# Altium schematic sheet Power.SchDoc
size C
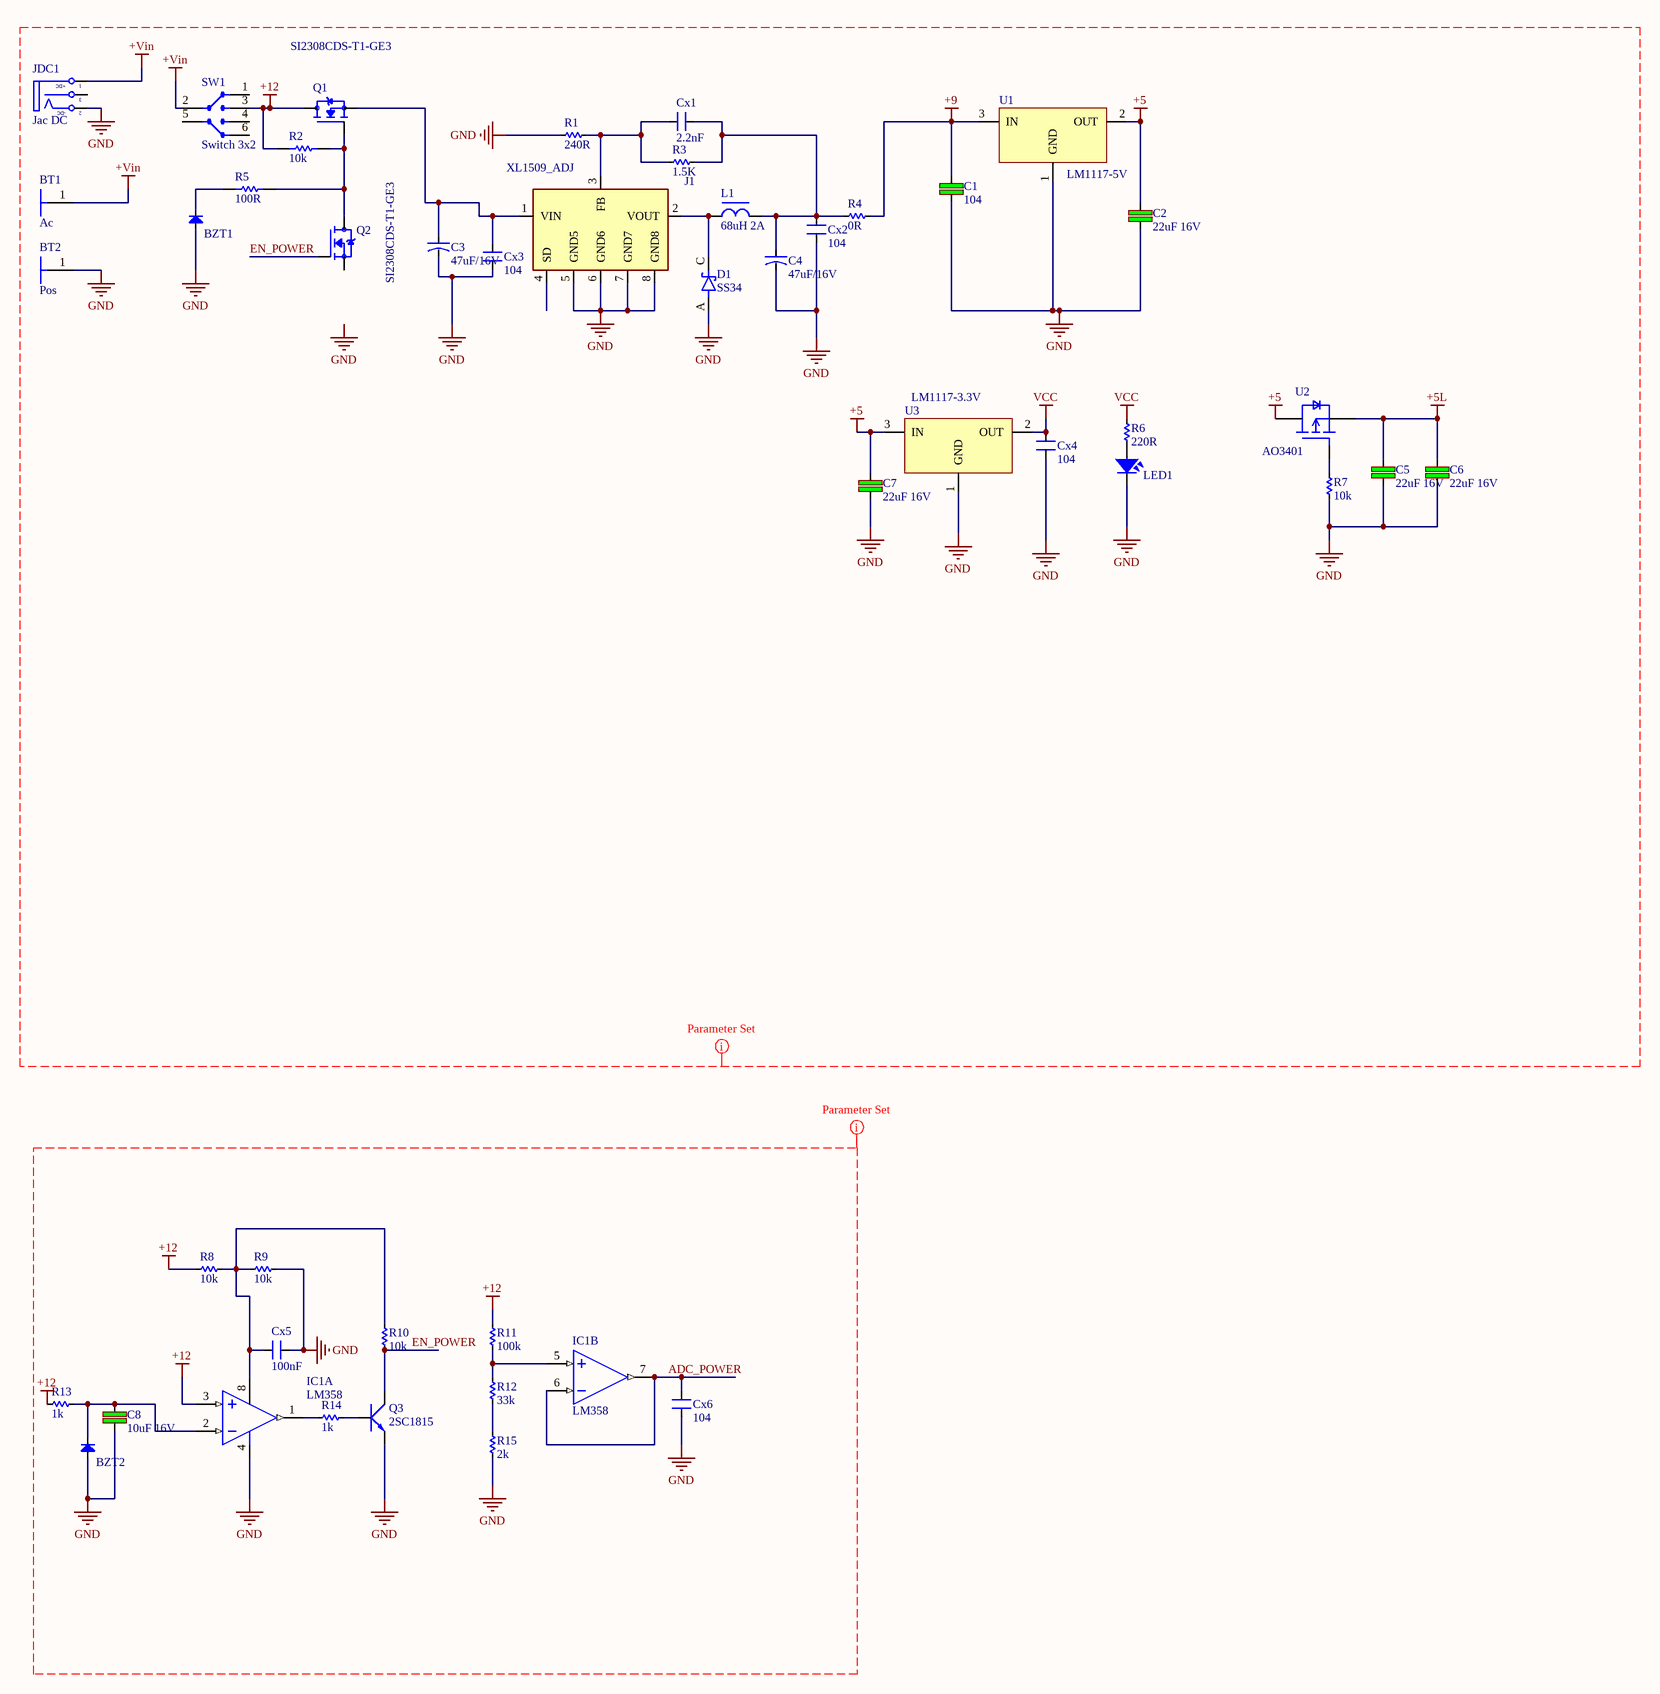
[diagram p0: Power.SchDoc]

## Parts
BT1  Ac  [BAT_BK-6223]
BT2  Pos  [BAT_BK-6223]
BZT1  Diode SMD  [DIO-SMD-123]  (value not drawn)
BZT2  Diode SMD  [DIO-SMD-123]  (value not drawn)
C1  104  [CN-SMD-0603]
C2  22uF 16V  [CN-SMD-1206]
C3  47uF/16V  [CAP-ALU-SMD-5.5x5.5]
C4  47uF/16V  [CAP-ALU-SMD-5.5x5.5]
C5  22uF 16V  [CN-SMD-1206]
C6  22uF 16V  [CN-SMD-1206]
C7  22uF 16V  [CN-SMD-1206]
C8  10uF 16V  [CN-SMD-1206]
Cx1  2.2nF  [CN-SMD-0603]
Cx2  104  [CN-SMD-0603]
Cx3  104  [CN-SMD-0603]
Cx4  104  [CN-SMD-0603]
Cx5  100nF  [CN-SMD-0603]
Cx6  104  [CN-SMD-0603]
D1  SS34  [DIOM5336X265N]
IC1  LM358  [SO8]  (parts A,B of 2)
J1  XL1509_ADJ  [SO08]
JDC1  Jac DC  [DC3]
L1  68uH 2A  [SMD Inductors CD54]
LED1  LED  [LED-0805-Blue]  (value not drawn)
Q1  SI2308CDS-T1-GE3  [SOT95P237X112-3N]
Q2  SI2308CDS-T1-GE3  [SOT95P237X112-3N]
Q3  2SC1815  [SOT23-321]
R1  240R  [RES-SMD-0603]
R2  value 10k  [RES-SMD-0603]  (hidden comment: 330)
R3  1.5K  [RES-SMD-0603]
R4  0R  [RES-SMD-0603]
R5  value 100R  [RES-SMD-0603]  (hidden comment: 330)
R6  220R  [RES-SMD-0603]
R7  10k  [RES-SMD-0603]
R8  10k  [RES-SMD-0603]
R9  10k  [RES-SMD-0603]
R10  10k  [RES-SMD-0603]
R11  100k  [RES-SMD-0603]
R12  33k  [RES-SMD-0603]
R13  1k  [RES-SMD-0603]
R14  1k  [RES-SMD-0603]
R15  2k  [RES-SMD-0603]
SW1  Switch 3x2  [SW3-DIP]
U1  LM1117-5V  [SOT223]
U2  AO3401  [SOT23-3]
U3  LM1117-3.3V  [SOT223]

## Nets
+5: C2.1 C7.1 U1.2(OUT) U2.3(D) U3.3(IN)
+5L: C5.1 C6.1 U2.2(S)
+9: C1.2 R4.2 U1.3(IN)
+12: IC1.3(IN+) Q1.3(D) R2.1 R8.1 R11.1 R13.2 SW1.3(I/O2)
+Vin: BT1.1 JDC1.1(T) SW1.2
GND: BT2.1 BZT1.1(A) BZT2.1(A) C1.1 C2.2 C3.2 C4.2 C5.2 C6.2 C7.2 C8.2 Cx2.1 Cx3.1 Cx4.1 Cx5.1 Cx6.1 D1.A IC1.4(-V) J1.5(GND5) J1.6(GND6) J1.7(GND7) J1.8(GND8) JDC1.2(TN) LED1.2 Q3.1(E) R1.1 R7.1 R9.2 R15.2 U1.1(GND) U3.1(GND)
VCC: Cx4.2 R6.2 U3.2(OUT)
ADC_POWER: Cx6.2 IC1.6(IN-) IC1.7(OUT)
EN_POWER: Q2.1(G) Q3.2(C) R10.1
NetBZT1_2: BZT1.2(K) R5.2
NetBZT2_2: BZT2.2(K) C8.1 IC1.2(IN-) R13.1
NetC3_1: C3.1 Cx3.2 J1.1(VIN) Q1.2(S)
NetC4_1: C4.1 Cx1.1 Cx2.2 L1.2 R3.2 R4.1
NetCx1_2: Cx1.2 J1.3(FB) R1.2 R3.1
NetCx5_2: Cx5.2 IC1.8(+V) R8.2 R9.1 R10.2
NetD1_C: D1.C(K) J1.2(VOUT) L1.1
NetIC1_1: IC1.1(OUT) R14.1
NetIC1_5: IC1.5(IN+) R11.2 R12.1
NetLED1_1: LED1.1 R6.1
NetQ1_1: Q1.1(G) Q2.3(D) R2.2 R5.1
NetQ3_3: Q3.3(B) R14.2
NetR7_2: R7.2 U2.1(G)
NetR12_2: R12.2 R15.1

Not connected (* = marked no-connect by the designer): J1 4(SD); JDC1 3(S); Q2 2(S); SW1 1 4 5(6) 6

## Layout directives
net class POWER: +5, +5L, +9, +12, +Vin, EN_POWER, GND, VCC
net class S_Power: +12, ADC_POWER, EN_POWER, GND

## Notes on the sheet
- Labels drawn without touching a wire or pin: GND
- (in symbol DCIN) +DC; -DC

## Library data of the parts
BT1 BT2 = BK-6223: AAAA Battery Contact; MF: MPD; Availability: Unavailable; Package: Non-Standard MPD; MP: BK-6223; Value: *; SnapEDA_Link: https://www.snapeda.com/parts/BK-6223/MPD/view-part/4614455/?ref=snap; Price: None
BZT1 BZT2 = Diode SMD: Default Diode; Code - JEDEC: DO-214-AB; Value: 1N5007; Published: 8-Jun-2000; Revision: July-2002: Re-released for DXP Platform.; Publisher: Altium Limited
C1 = C: Cap SMD; Value: 103
C2 C5-C8 = C: Cap SMD 1206 >5V; Value: 103
C3 C4 = CN-ALU-SMD: Polarized Capacitor (Axial); Published: 8-Jun-2000; LatestRevisionDate: 17-Jul-2002; LatestRevisionNote: Re-released for DXP Platform.; PackageReference: POLAR0.8; Publisher: Altium Limited
Cx1-Cx6 = CN: Value: 33pF
D1 = SS24: 1; MF: TE Connectivity / Alcoswitch; Mouser-Purchase-URL: https://snapeda.com/shop?store=Mouser&id=1080652; SnapEDA_Link: https://www.snapeda.com/parts/SS24/TE%20Connectivity%20/%20Alcoswitch/view-part/1080652/?ref=snap; Package: DO-214AA-214 TE Connectivity / Alcoswitch; MP: SS24; Value: *; Arrow_Electronics-Purchase-URL: https://snapeda.com/shop?store=Arrow+Electronics&id=1080652
IC1 = LM358: Low-Power Dual Operational Amplifier; Value: LM358
J1 = AP1509-50SG-13: Buck Switching Regulator IC Positive Fixed 5V 1 Output 2A 8-SOIC (0.154, 3.90mm Width); MF: Diodes Inc.; SnapEDA_Link: https://www.snapeda.com/parts/AP1509-50SG-13/Diodes%20Inc./view-part/1039892/?ref=snap; MP: AP1509-50SG-13; Availability: Good; Price: None; Package: SOP-8 Diodes Inc.; Value: *; Check_prices: https://www.snapeda.com/parts/AP1509-50SG-13/Diodes%20Inc./view-part/1039892/?ref=eda; Purchase-URL: https://pricing.snapeda.com/search/part/AP1509-50SG-13/?ref=eda
JDC1 = DCIN: Jac DC input; Value: Jac DC
L1 = L-DIP-1: Inductor; Value: 150 mH
LED1 = LED SMD: Value: LED 3 - 5 ly 2 Colour
Q1 Q2 = SI2308CDS-T1-GE3: N-Channel 60V 2.6A (Tc) 1.6W (Tc) Surface Mount SOT-23-3 (TO-236); MF: Vishay Siliconix; Package: SOT-23-3 Vishay Siliconix; MP: SI2308CDS-T1-GE3; Value: *; SnapEDA_Link: https://www.snapeda.com/parts/SI2308CDS-T1-GE3/Vishay%20Siliconix/view-part/2523766/?ref=snap; Availability: Unavailable; Price: None
Q3 = 2SC1815: NPN 600mW, ECB; Value: C1815
R1 R3 R4 R6-R15 = Res-SMD: Resistor; Manufacturer: Generic Components; Class: Passive; Published: 08/06/2000; Publisher: Altium Hobart Technology Centre
R2 R5 = RESISTOR SMD: 330R
SW1 = SW3x2: Value: Switch 4x2
U1 U3 = LM1117: 800mA Low-Dropout Linear Regulator; Creator: Nguyen Ba Bien; Website: http://group3i.net
U2 = AO3401: P-Channel 30V 4A (Ta) 1.4W (Ta) Surface Mount SOT-23-3L; MF: Alpha & Omega Semiconductor; Price: None; SnapEDA_Link: https://www.snapeda.com/parts/AO3401/Alpha%20&%20Omega%20Semiconductor/view-part/4795619/?ref=snap; Arrow_Electronics-Purchase-URL: https://snapeda.com/shop?store=Arrow+Electronics&id=4795619; Availability: Warning; MP: AO3401; Value: *; Package: SOT-23-3 Alpha &amp; Omega Semiconductor